# Altium schematic sheet OLED-0.96-Demo-MCU+Board.SchDoc
size A4
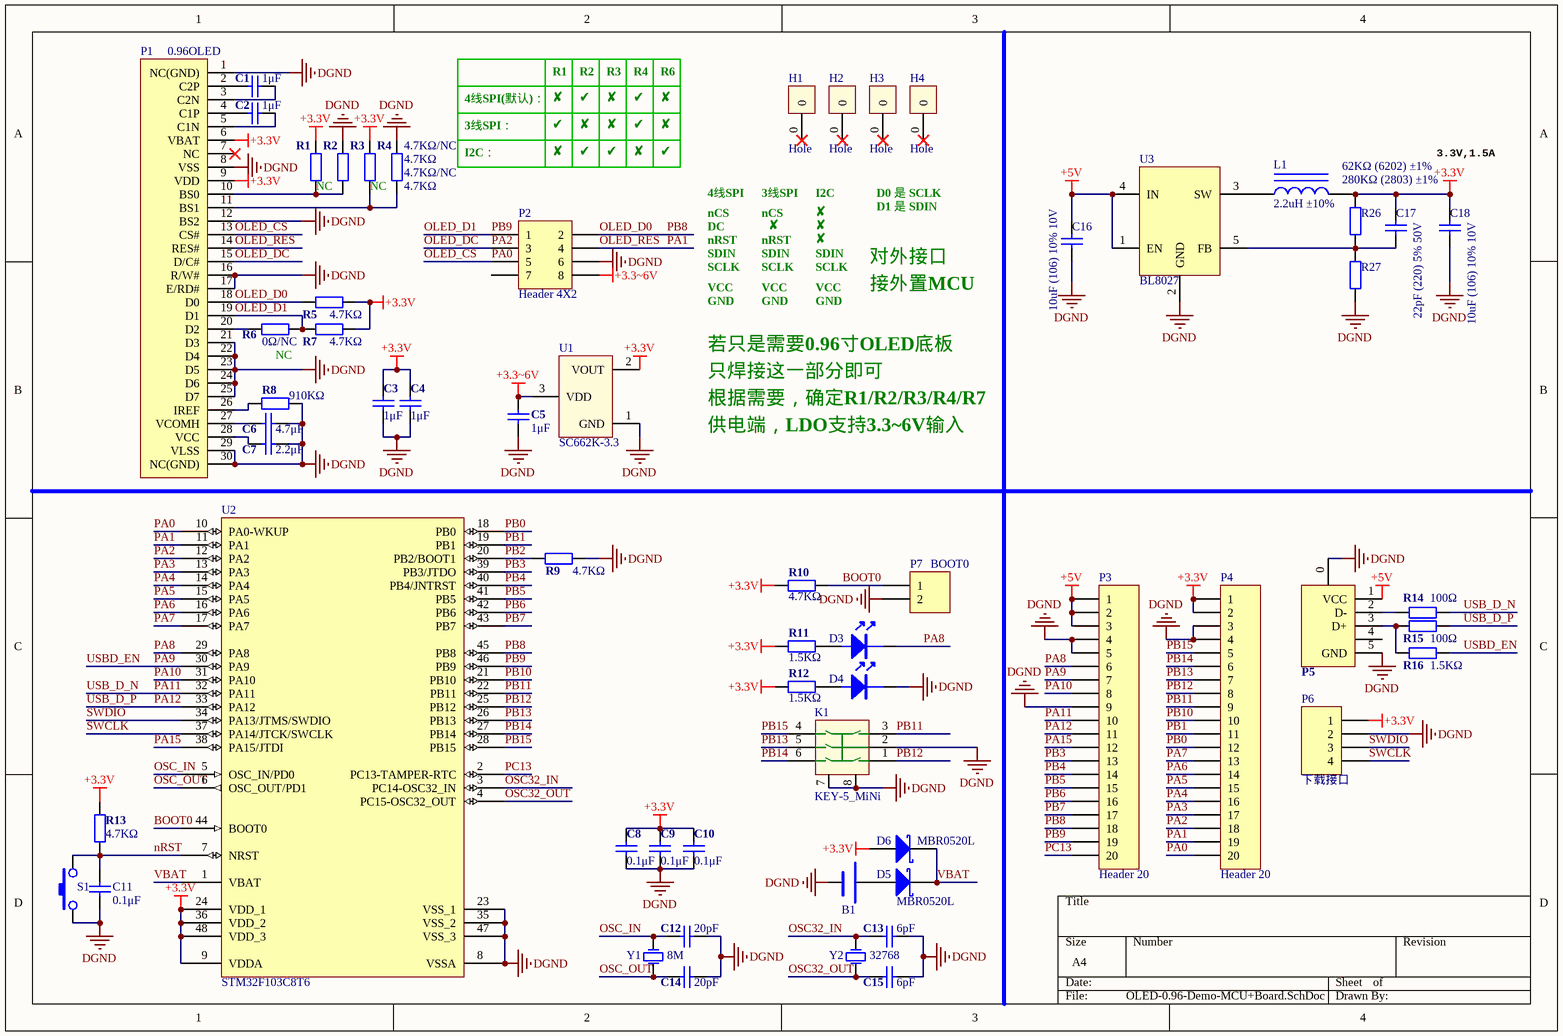
[diagram p0: OLED-0.96-Demo-MCU+Board.SchDoc]

## Parts
B1  BAT  [BATTERY SOCKET]  (value not drawn)
C1  1μF  [LC-0603_C]
C2  1μF  [LC-0603_C]
C3  1μF  [LC-0603_C]
C4  1μF  [LC-0603_C]
C5  1μF  [LC-0603_C]
C6  4.7μF  [LC-0603_C]
C7  2.2μF  [LC-0603_C]
C8  0.1μF  [LC-0603_C]
C9  0.1μF  [LC-0603_C]
C10  0.1μF  [LC-0603_C]
C11  0.1μF  [LC-0603_C]
C12  20pF  [LC-0603_C]
C13  6pF  [LC-0603_C]
C14  20pF  [LC-0603_C]
C15  6pF  [LC-0603_C]
C16  10uF (106) 10% 10V  [LC-0603_C]
C17  22pF (220) 5% 50V  [LC-0603_C]
C18  10uF (106) 10% 10V  [LC-0603_C]
D3  POWER  [LC-0603_LED_S1]  (value not drawn)
D4  POWER  [LC-0603_LED_S1]  (value not drawn)
D5  MBR0520L  [LC-SOD-123]
D6  MBR0520L  [LC-SOD-123]
H1  Hole  [Hole]
H2  Hole  [Hole]
H3  Hole  [Hole]
H4  Hole  [Hole]
K1  KEY-5_MiNi  [KEY_5_mini]
L1  2.2uH ±10%  [LC-0805_L]
P1  0.96OLED  [OLED_0.96]
P2  Header 4X2  [2*4P_SMT]
P3  Header 20  [HDR1X20]
P4  Header 20  [HDR1X20]
P5  Micro USB,母头  [MicroUSB2]  (value not drawn)
P6  下载接口  [HDR1X4]
P7  BOOT0  [HDR1X2]
R1  4.7KΩ/NC  [LC-0603_R]
R2  4.7KΩ  [LC-0603_R]
R3  4.7KΩ/NC  [LC-0603_R]
R4  4.7KΩ  [LC-0603_R]
R5  4.7KΩ  [LC-0603_R]
R6  0Ω/NC  [LC-0603_R]
R7  4.7KΩ  [LC-0603_R]
R8  910KΩ  [LC-0603_R]
R9  4.7KΩ  [LC-0603_R]
R10  4.7KΩ  [LC-0603_R]
R11  1.5KΩ  [LC-0603_R]
R12  1.5KΩ  [LC-0603_R]
R13  4.7KΩ  [LC-0603_R]
R14  100Ω  [LC-0603_R]
R15  100Ω  [LC-0603_R]
R16  1.5KΩ  [LC-0603_R]
R26  280KΩ (2803) ±1%  [LC-0603_R]
R27  62KΩ (6202) ±1%  [LC-0603_R]
S1  微动开关  [按键]  (value not drawn)
U1  SC662K-3.3  [LC-SOT-23(SOT-23-3)]
U2  STM32F103C8T6  [LC-LQFP-48_7x7x05P]
U3  BL8027  [LC-SOT-23-5]
Y1  8M  [LC-HC-49SMD]
Y2  32768  [MC-306]

## Nets
+3.3V: C3.2 C4.2 C8.2 C9.2 C10.2 C17.2 C18.2 D6.1(A) L1.2 P1.6(VBAT) P1.9(VDD) P4.1 P4.2 P6.1 R1.2 R3.1 R5.1 R7.1 R10.2 R11.2 R12.2 R13.2 R26.1 U1.2(VOUT) U2.9(VDDA) U2.24(VDD_1) U2.36(VDD_2) U2.48(VDD_3)
+3.3~6V: C5.1 P2.8 U1.3(VDD)
+5V: C16.2 P3.1 P3.2 P3.3 P5.1(VCC) U3.1(EN) U3.4(IN)
DGND: B1.2 C3.1 C4.1 C5.2 C6.1 C7.1 C8.1 C9.1 C10.1 C11.1 C12.2 C13.2 C14.2 C15.2 C16.1 C18.1 D4.K K1.2 K1.7 K1.8 P1.1(NC(GND)) P1.8(VSS) P1.12(BS2) P1.16(R/W#) P1.17(E/RD#) P1.21(D3) P1.22(D4) P1.23(D5) P1.24(D6) P1.25(D7) P1.29(VLSS) P1.30(NC(GND)) P2.6 P3.4 P3.5 P3.9 P4.3 P4.4 P5.0(GND) P5.5(GND) P6.2 P7.2 R2.2 R4.1 R8.1 R9.1 R27.1 S1.1 U1.1(GND) U2.8(VSSA) U2.23(VSS_1) U2.35(VSS_2) U2.47(VSS_3) U3.2(GND)
BOOT0: P7.1 R10.1 U2.44(BOOT0)
nRST: C11.2 R13.1 S1.2 U2.7(NRST)
OLED_CS: P1.13(CS#) P2.5 P4.20 U2.10(PA0-WKUP)  [also labelled PA0]
OLED_D0: P1.18(D0) P2.2 P3.18 R5.2 U2.45(PB8)  [also labelled PB8]
OLED_D1: P1.19(D1) P2.1 P3.19 R6.1 R7.2 U2.46(PB9)  [also labelled PB9]
OLED_DC: P1.15(D/C#) P2.3 P4.18 U2.12(PA2)  [also labelled PA2]
OLED_RES: P1.14(RES#) P2.4 P4.19 U2.11(PA1)  [also labelled PA1]
OSC32_IN: C13.1 U2.3(PC14-OSC32_IN) Y2.1
OSC32_OUT: C15.1 U2.4(PC15-OSC32_OUT) Y2.4
OSC_IN: C12.1 U2.5(OSC_IN/PD0) Y1.1
OSC_OUT: C14.1 U2.6(OSC_OUT/PD1) Y1.2
PA3: P4.17 U2.13(PA3)
PA4: P4.16 U2.14(PA4)
PA5: P4.15 U2.15(PA5)
PA6: P4.14 U2.16(PA6)
PA7: P4.13 U2.17(PA7)
PA8: D3.K P3.6 U2.29(PA8)
PA9: P3.7 R16.1 U2.30(PA9)  [also labelled USBD_EN]
PA10: P3.8 U2.31(PA10)
PA11: P3.10 R14.1 U2.32(PA11)  [also labelled USB_D_N]
PA12: P3.11 R15.1 U2.33(PA12)  [also labelled USB_D_P]
PA15: P3.12 U2.38(PA15/JTDI)
PB0: P4.12 U2.18(PB0)
PB1: P4.11 U2.19(PB1)
PB2: R9.2 U2.20(PB2/BOOT1)
PB3: P3.13 U2.39(PB3/JTDO)
PB4: P3.14 U2.40(PB4/JNTRST)
PB5: P3.15 U2.41(PB5)
PB6: P3.16 U2.42(PB6)
PB7: P3.17 U2.43(PB7)
PB10: P4.10 U2.21(PB10)
PB11: K1.3 P4.9 U2.22(PB11)
PB12: K1.1 P4.8 U2.25(PB12)
PB13: K1.5 P4.7 U2.26(PB13)
PB14: K1.6 P4.6 U2.27(PB14)
PB15: K1.4 P4.5 U2.28(PB15)
PC13: P3.20 U2.2(PC13-TAMPER-RTC)
SWCLK: P6.4 U2.37(PA14/JTCK/SWCLK)
SWDIO: P6.3 U2.34(PA13/JTMS/SWDIO)
VBAT: D5.2(K) D6.2(K) U2.1(VBAT)
NetB1_1: B1.1 D5.1(A)
NetC1_1: C1.1 P1.3(C2N)
NetC1_2: C1.2 P1.2(C2P)
NetC2_1: C2.1 P1.5(C1N)
NetC2_2: C2.2 P1.4(C1P)
NetC6_2: C6.2 P1.27(VCOMH)
NetC7_2: C7.2 P1.28(VCC)
NetC17_1: C17.1 R26.2 R27.2 U3.5(FB)
NetD3_A: D3.A R11.1
NetD4_A: D4.A R12.1
NetL1_1: L1.1 U3.3(SW)
NetP1_10: P1.10(BS0) R1.1 R2.1
NetP1_11: P1.11(BS1) R3.2 R4.2
NetP1_20: P1.20(D2) R6.2
NetP1_26: P1.26(IREF) R8.2
NetP5_2: P5.2(D-) R14.2
NetP5_3: P5.3(D+) R15.2 R16.2

Not connected (* = marked no-connect by the designer): H1 0*; H2 0*; H3 0*; H4 0*; P1 7(NC)*; P2 7; P5 4

## Notes on the sheet
- 4线SPI(默认)：
- R1
- ✘
- ✔
- R2
- R3
- R4
- R6
- 3线SPI：
- I2C：
- 3.3V,1.5A
- (near R1) NC
- (near R3) NC
- nCS
- DC
- nRST
- 4线SPI
- 3线SPI
- I2C
- D0 是 SCLK
- D1 是 SDIN
- SDIN
- SCLK
- VCC
- GND
- 对外接口
- 接外置MCU
- (near R6) NC
- 若只是需要0.96寸OLED底板
- 只焊接这一部分即可
- 根据需要，确定R1/R2/R3/R4/R7
- 供电端，LDO支持3.3~6V输入

## Library data of the parts
B1 = BAT: 电池; Value: 红色; 物料: *; 名称: *; 规格: *; 封装: *; 设备: *; RoHS: *; 贴?: *; 器件: *; ComponentLink1Description: *; ComponentLink1URL: *
C1-C5 = Cap: 贴片电容; 名称: 电容; 封装: 0805; 型号: 1μF
C6-C15 = Cap: 贴片电容; 名称: 电容; 封装: 0805; 型号: 1μF
C16 C18 = 0603 10uF (106) 10% 10V: 贴片电容; ComponentLink1Description: 供应商链接; ComponentLink1URL: http://www.szlcsc.com/product/details_20411.html; Package: 0603; Supplier: LC; SuppliersPartNumber: C19702
C17 = 0402 22pF (220) 5% 50V: 贴片电容; ComponentLink1Description: 供应商链接; ComponentLink1URL: http://www.szlcsc.com/product/details_1907.html; Package: 0402; Supplier: LC; SuppliersPartNumber: C1555
D3 D4 = LED1: 发光二极管; Value: 红色; 物料: *; 名称: *; 规格: *; 封装: *; 设备: *; RoHS: *; 贴?: *; 器件: *; ComponentLink1Description: *; ComponentLink1URL: *
D5 D6 = Diode 18TQ045: 贴片肖特基二极管; Note: Terminal 2 is the TAB and is electrically connected to the cathode; Published: 8-Jun-2000; LatestRevisionDate: 17-Jul-2002; LatestRevisionNote: Re-released for DXP Platform.; DatasheetVersion: Dec-1997; PackageVersion: Feb-1998; PackageReference: TO-220AC; Publisher: Altium Limited; PackageDescription: TO, Thru-Hole, Vertical, Heatsink Mounted; 3 In-Line Leads (1 Absent); Pitch 2.54 mm; ComponentLink1Description: Manufacturer Link; ComponentLink1URL: http://www.irf.com/; ComponentLink2Description: Datasheet; ComponentLink2URL: http://www.irf.com/product-info/datasheets/data/18tq.pdf
H1-H4 = Hole: 螺丝孔; Value: 螺丝孔
K1 = KEY-5_MiNi: 贴片五向开关
L1 = 0805 2.2uH 10%: 贴片电感; ComponentLink1Description: 供应商链接; ComponentLink1URL: http://www.szlcsc.com/product/details_1395.html; Package: 0805; Supplier: LC; SuppliersPartNumber: C1043
P1 = 0.96OLED: 接口; LatestRevisionDate: 17-Jul-2002; LatestRevisionNote: Re-released for DXP Platform.; Publisher: Altium Limited
P2 = Header 4X2: Header, 4-Pin, Dual row; LatestRevisionDate: 17-Jul-2002; LatestRevisionNote: Re-released for DXP Platform.; Publisher: Altium Limited
P3 P4 = Header 20: Header, 20-Pin; LatestRevisionDate: 17-Jul-2002; LatestRevisionNote: Re-released for DXP Platform.; Publisher: Altium Limited
P5 = microUSB: 接口
P6 = Header 4: Header, 4-Pin; LatestRevisionDate: 17-Jul-2002; LatestRevisionNote: Re-released for DXP Platform.; Publisher: Altium Limited
P7 = Header 2: Header, 2-Pin; LatestRevisionDate: 17-Jul-2002; LatestRevisionNote: Re-released for DXP Platform.; Publisher: Altium Limited
R1-R16 = 电阻: 贴片电阻; 型号: 1KΩ; 名称: 电阻
R26 R27 = 0805 62KΩ (6202) 1%: 贴片电阻; ComponentLink1Description: 供应商链接; Package: 0402; Supplier: LC; SuppliersPartNumber: C17783
  R27: ComponentLink1URL: http://www.szlcsc.com/product/details_18471.html
S1 = 微动开关: 名称: 开关; 型号: 微动，轻触; 封装: *; 厂商: *
U1 = SC662K-3.3: IC
U2 = STM32F103CBT6: IC; 封装: LQFP48; 厂商: ST; Published: 30-May-2008; DatasheetVersion: rev6, Mar-2008; PackageVersion: Mar-2008; PackageReference: LQFP48; Publisher: Altium Limited; PackageDescription: 48-Pin Low-Profile Quad Flat Pack, 7 x 7 mm Body, 0.5 mm Pitch (LQFP48); ComponentLink1Description: Manufacturer Link; ComponentLink1URL: www.st.com/stm32; ComponentLink2Description: Datasheet; ComponentLink2URL: http://www.st.com/stonline/products/literature/ds/13587.pdf; 名称: IC; 型号: STM32F103CBT6
U3 = DC-DC: IC
Y1 Y2 = XTAL_1: 晶振（直插）; Value: 25MHz ±20ppm 20pF; Published: 8-Jun-2000; LatestRevisionDate: 17-Jul-2002; LatestRevisionNote: Re-released for DXP Platform.; PackageReference: R38; Publisher: Altium Limited